# EAGLE design nanoled 2x mosfet +split (EAGLE 7.6.0)
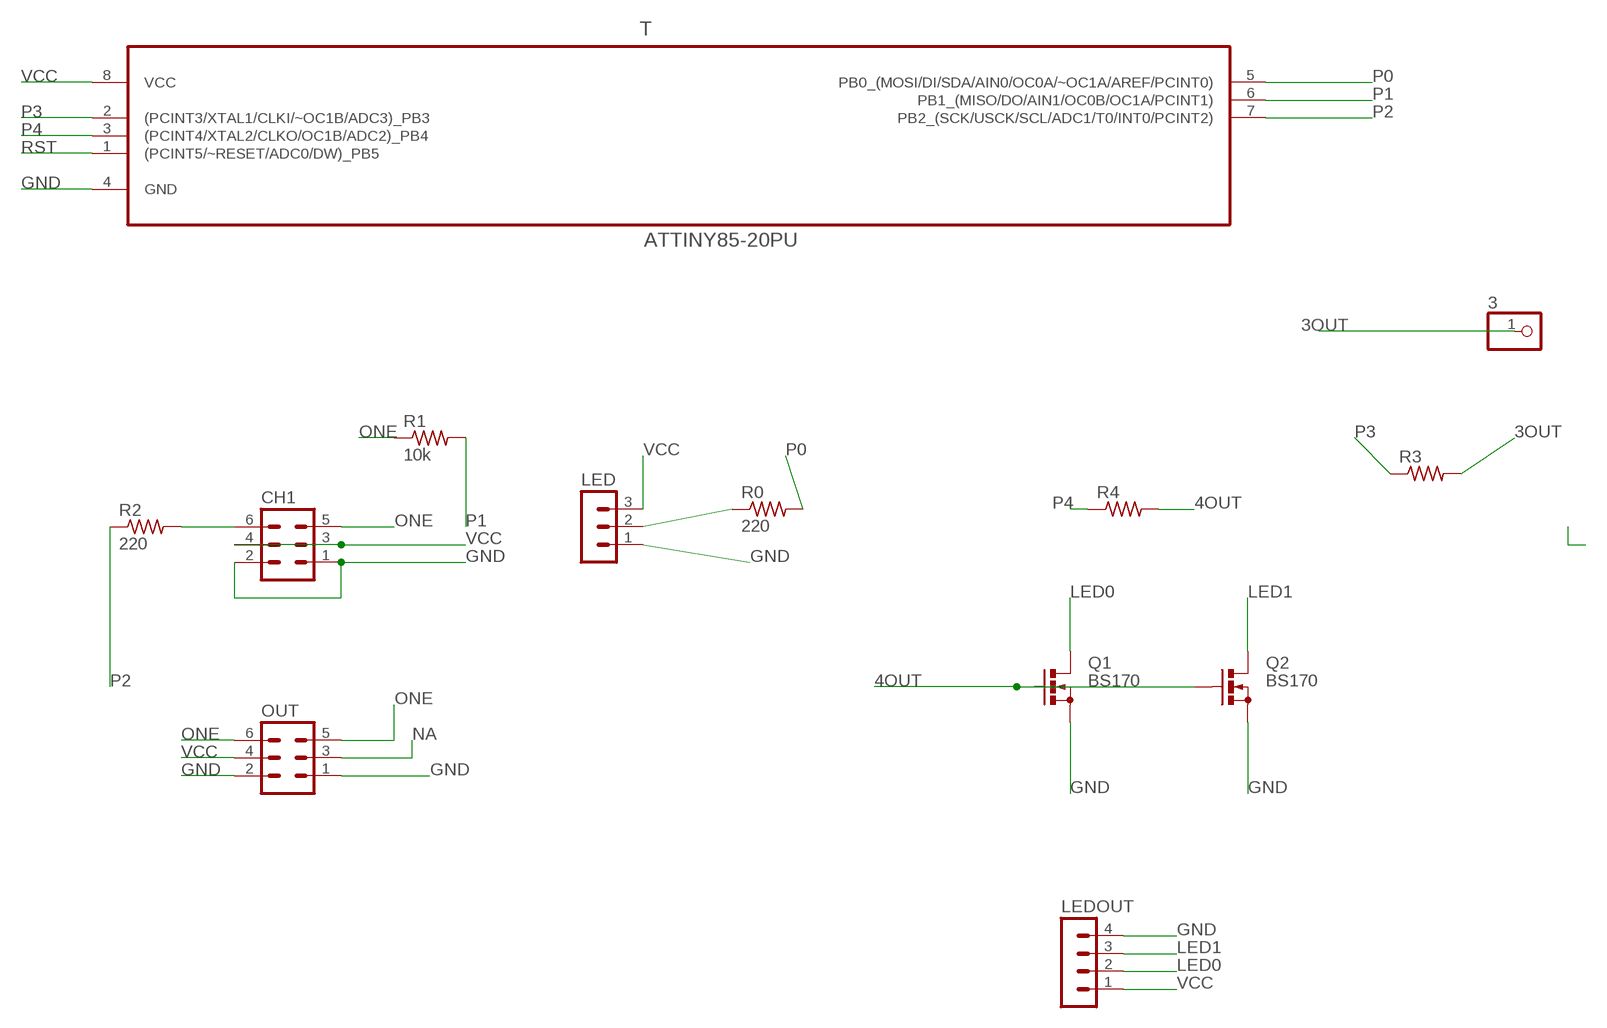
[diagram p0: schematic, sheet 1]

## Parts
3  PINHD-1X1  [1X01]
CH1  MA03-2  [MA03-2]
LED  MA03-1  [MA03-1]
LEDOUT  MA04-1  [MA04-1]
OUT  MA03-2  [MA03-2]
Q1  BS170  [SOT54E]
Q2  BS170  [SOT54E]
R0  220  R-US_0204/7  [0204/7]
R1  10k  R-US_0204/7  [0204/7]
R2  220  R-US_0204/7  [0204/7]
R3  R-US_0204/7  [0204/7]
R4  R-US_0204/7  [0204/7]
T  ATTINY85-20PU  [DIP254P762X533-8]

## Nets
3OUT: 3.1 R3.2
4OUT: Q1.G Q2.G R4.2
GND: CH1.1 CH1.2 LED.1 LEDOUT.4 OUT.1 OUT.2 Q1.S Q2.S T.4(GND)
LED0: LEDOUT.2 Q1.D
LED1: LEDOUT.3 Q2.D
N$1: LED.2 R0.1
N$4: CH1.6 R2.2
NA: OUT.3
ONE: CH1.5 OUT.5 OUT.6 R1.1
P0: R0.2 T.5(PB0_(MOSI/DI/SDA/AIN0/OC0A/~OC1A/AREF/PCINT0))
P1: R1.2 T.6(PB1_(MISO/DO/AIN1/OC0B/OC1A/PCINT1))
P2: R2.1 T.7(PB2_(SCK/USCK/SCL/ADC1/T0/INT0/PCINT2))
P3: R3.1 T.2((PCINT3/XTAL1/CLKI/~OC1B/ADC3)_PB3)
P4: R4.1 T.3((PCINT4/XTAL2/CLKO/OC1B/ADC2)_PB4)
RST: T.1((PCINT5/~RESET/ADC0/DW)_PB5)
VCC: CH1.3 CH1.4 LED.3 LEDOUT.1 OUT.4 T.8(VCC)

## Library data of the parts
3 = adafruit:PINHD-1X1: Pin header 1x1 for 0.1" spacing With round pins
CH1 OUT = con-lstb:MA03-2: PIN HEADER; OC_FARNELL: unknown; OC_NEWARK: unknown
LED = con-lstb:MA03-1: PIN HEADER; OC_FARNELL: unknown; OC_NEWARK: unknown
LEDOUT = con-lstb:MA04-1: PIN HEADER; OC_FARNELL: unknown; OC_NEWARK: unknown
Q1 Q2 = transistor-small-signal:BS170: N-CHANNEL MOS FET
R0 R1-R4 = resistor:R-US_: RESISTOR, American symbol
T = Atmel_By_element14_Batch_1-00:ATTINY85-20PU: 8-bit Microcontroller with In-System Programmable Flash; MPN: ATTINY85-20PU; OC_FARNELL: 1455162; OC_NEWARK: 58M3796; PACKAGE: PDIP-8; SUPPLIER: Atmel

## Board
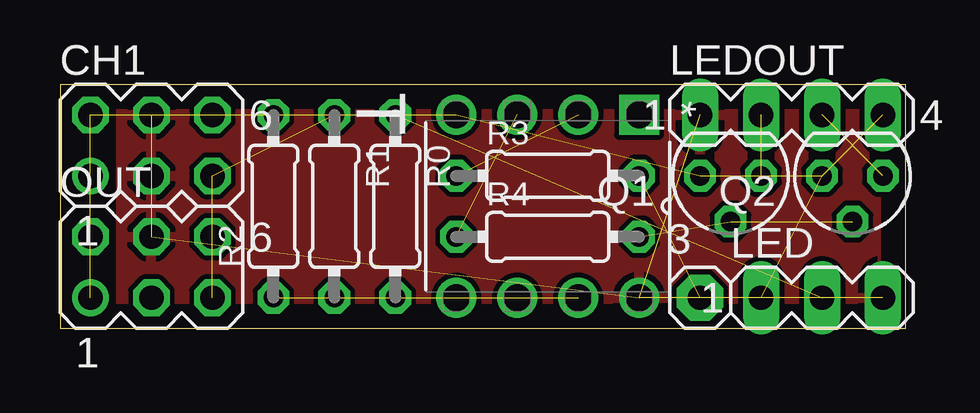
[diagram p1: board, top side]
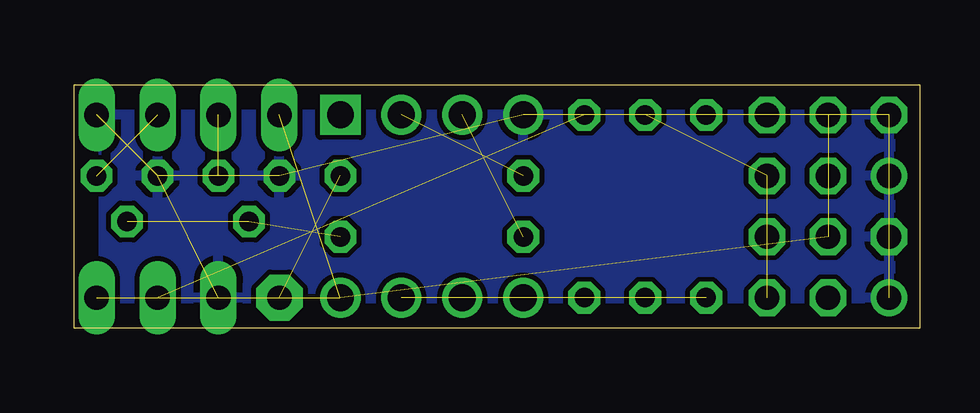
[diagram p2: board, bottom side, seen from below]

Size 35.23 x 10.15 mm. Coordinates in mm from the lower left corner, seen from the top.
Outline: 0,0 35.23,0 35.23,10.15 0,10.15 0,0
Copper layers (1*16): Top 0.035mm / dielectric 1.5mm / Bottom 0.035mm
Design rules "default": minimum track width 10mil, minimum drill 24mil, track to track 8mil, track to pad 8mil, pad to pad 8mil, via to via 8mil, smd to smd 8mil, copper to edge 40mil, drill to drill 8mil, minimum pad ring 10mil, minimum via ring 8mil, stop-mask expansion 4mil, vias tented up to drill 0mil, thermal gap 10mil

### Footprints (pad centres in the part's own frame; a part is rotated, then mirrored left to right if it is on the bottom)
1X01 = drill 1.016 pad 1.93 octagon: 1 0,0
MA03-2 = drill 1.016: 1 -2.54,-1.27 | drill 1.016 octagon: 2 -2.54,1.27; 3 0,-1.27; 4 0,1.27; 5 2.54,-1.27; 6 2.54,1.27
MA03-1 = drill 1.016 long: 1 -2.54,0; 2 0,0; 3 2.54,0
MA04-1 = drill 1.016 long: 1 -3.81,0; 2 -1.27,0; 3 1.27,0; 4 3.81,0
SOT54E = drill 0.813 octagon: D -1.27,0; G 0,1.905; S 1.27,0
0204/7 = drill 0.813 octagon: 1 -3.81,0; 2 3.81,0
DIP254P762X533-8 = drill 1.118 square: 1 -7.62,7.62 | drill 1.118: 2 -7.62,5.08; 3 -7.62,2.54; 4 -7.62,0; 5 0,0; 6 0,2.54; 7 0,5.08; 8 0,7.62

### Placement (x,y rotation side)
3  26.67,1.27 0 top
CH1  3.81,7.62 0 top
LED  31.75,1.27 0 top
LEDOUT  30.48,8.89 0 top
OUT  3.81,2.54 0 top
Q1  27.94,6.35 180 top
Q2  33.02,6.35 180 top
R0  13.97,5.08 270 top
R1  11.43,5.08 270 top
R2  8.89,5.08 90 top
R3  20.32,6.35 0 top
R4  20.32,3.81 0 top
T  16.51,1.27 270 top

### Tracks (layer width: path | path; a pad name or v marks a point on that pad's centre or on a via)
3OUT  (1 unrouted)
4OUT  (2 unrouted)
GND  (8 unrouted)
  pour Bottom: 0,10.16 0,0 35.56,0 35.56,10.16
LED0  (1 unrouted)
LED1  (1 unrouted)
N$1  (1 unrouted)
N$4  (1 unrouted)
ONE  (3 unrouted)
P0  (1 unrouted)
P1  (1 unrouted)
P2  (1 unrouted)
P3  (1 unrouted)
P4  (1 unrouted)
VCC  (5 unrouted)
  pour Top: 2.54,10.16 2.54,0 35.56,0 35.56,10.16